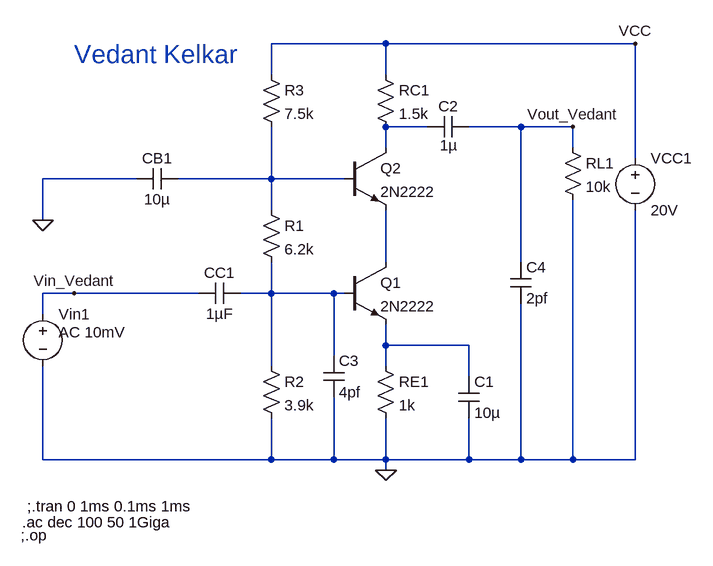
[diagram p0: schematic ECAD_exp5.asc]
ECAD_exp5.asc, the LTspice schematic file:
Version 4
SHEET 1 880 680
WIRE 272 -128 96 -128
WIRE 656 -128 272 -128
WIRE 96 -80 96 -128
WIRE 272 -80 272 -128
WIRE 336 0 272 0
WIRE 480 0 400 0
WIRE 560 0 480 0
WIRE 272 32 272 0
WIRE 560 32 560 0
WIRE 656 48 656 -128
WIRE -112 80 -256 80
WIRE 96 80 96 0
WIRE 96 80 -48 80
WIRE 208 80 96 80
WIRE 96 128 96 80
WIRE -256 144 -256 80
WIRE 272 208 272 128
WIRE 480 208 480 0
WIRE -208 256 -256 256
WIRE -16 256 -208 256
WIRE 96 256 96 208
WIRE 96 256 48 256
WIRE 192 256 96 256
WIRE 208 256 192 256
WIRE -256 288 -256 256
WIRE 272 336 272 304
WIRE 400 336 272 336
WIRE 192 352 192 256
WIRE 96 368 96 256
WIRE 272 368 272 336
WIRE 400 384 400 336
WIRE -256 512 -256 368
WIRE 96 512 96 448
WIRE 96 512 -256 512
WIRE 192 512 192 416
WIRE 192 512 96 512
WIRE 272 512 272 448
WIRE 272 512 192 512
WIRE 400 512 400 448
WIRE 400 512 272 512
WIRE 480 512 480 272
WIRE 480 512 400 512
WIRE 560 512 560 112
WIRE 560 512 480 512
WIRE 656 512 656 128
WIRE 656 512 560 512
WIRE 272 528 272 512
FLAG 272 528 0
FLAG -208 256 Vin_Vedant
FLAG -256 144 0
FLAG 560 0 Vout_Vedant
FLAG 656 -128 VCC
SYMBOL res 80 112 R0
SYMATTR InstName R1
SYMATTR Value 6.2k
SYMBOL res 256 352 R0
SYMATTR InstName RE1
SYMATTR Value 1k
SYMBOL res 80 352 R0
SYMATTR InstName R2
SYMATTR Value 3.9k
SYMBOL cap 48 240 R90
WINDOW 0 0 32 VBottom 2
WINDOW 3 32 32 VTop 2
SYMATTR InstName CC1
SYMATTR Value 1µF
SYMBOL voltage -256 272 R0
WINDOW 123 24 44 Left 2
WINDOW 39 0 0 Left 0
WINDOW 3 21 91 Left 2
SYMATTR Value2 AC 10mV
SYMATTR Value ""
SYMATTR InstName Vin1
SYMBOL npn 208 208 R0
SYMATTR InstName Q1
SYMATTR Value 2N2222
SYMBOL cap 384 384 R0
SYMATTR InstName C1
SYMATTR Value 10µ
SYMATTR SpiceLine V=6.3 Irms=0 Rser=0.001 Lser=0 mfg="TDK" pn="C3216X5ROJ106M" type="X5R"
SYMBOL npn 208 32 R0
SYMATTR InstName Q2
SYMATTR Value 2N2222
SYMBOL res 80 -96 R0
SYMATTR InstName R3
SYMATTR Value 7.5k
SYMBOL res 256 -96 R0
SYMATTR InstName RC1
SYMATTR Value 1.5k
SYMBOL cap 400 -16 R90
WINDOW 0 0 32 VBottom 2
WINDOW 3 29 31 VTop 2
SYMATTR InstName C2
SYMATTR Value 1µ
SYMBOL res 544 16 R0
SYMATTR InstName RL1
SYMATTR Value 10k
SYMBOL voltage 656 32 R0
WINDOW 123 0 0 Left 0
WINDOW 39 0 0 Left 0
SYMATTR InstName VCC1
SYMATTR Value 20V
SYMBOL cap -48 64 R90
WINDOW 0 0 32 VBottom 2
WINDOW 3 32 32 VTop 2
SYMATTR InstName CB1
SYMATTR Value 10µ
SYMBOL cap 176 352 R0
SYMATTR InstName C3
SYMATTR Value 4pf
SYMBOL cap 464 208 R0
SYMATTR InstName C4
SYMATTR Value 2pf
TEXT -208 -112 Left 4 ;Vedant Kelkar
TEXT -280 584 Left 2 !;.tran 0 1ms 0.1ms 1ms
TEXT -288 608 Left 2 !.ac dec 100 50 1Giga
TEXT -290 628 Left 2 !;.op

The netlist it stands for:
* ECAD_exp5.asc
R1 N002 N004 6.2k
RE1 N005 0 1k
R2 N004 0 3.9k
CC1 N004 Vin_Vedant 1µF
Vin1 Vin_Vedant 0 AC 10mV
Q1 N003 N004 N005 0 2N2222
C1 N005 0 10µ V=6.3 Irms=0 Rser=0.001 Lser=0 mfg="TDK" pn="C3216X5ROJ106M" type="X5R"
Q2 N001 N002 N003 0 2N2222
R3 VCC N002 7.5k
RC1 VCC N001 1.5k
C2 Vout_Vedant N001 1µ
RL1 Vout_Vedant 0 10k
VCC1 VCC 0 20V
CB1 N002 0 10µ
C3 N004 0 4pf
C4 Vout_Vedant 0 2pf
.model NPN NPN
.model PNP PNP
.lib standard.bjt
* Vedant Kelkar
;.tran 0 1ms 0.1ms 1ms
.ac dec 100 50 1Giga
;.op
.backanno
.end